# Altium schematic sheet 03_PHOTOELECTRIC_SENSOR.SchDoc
size A3
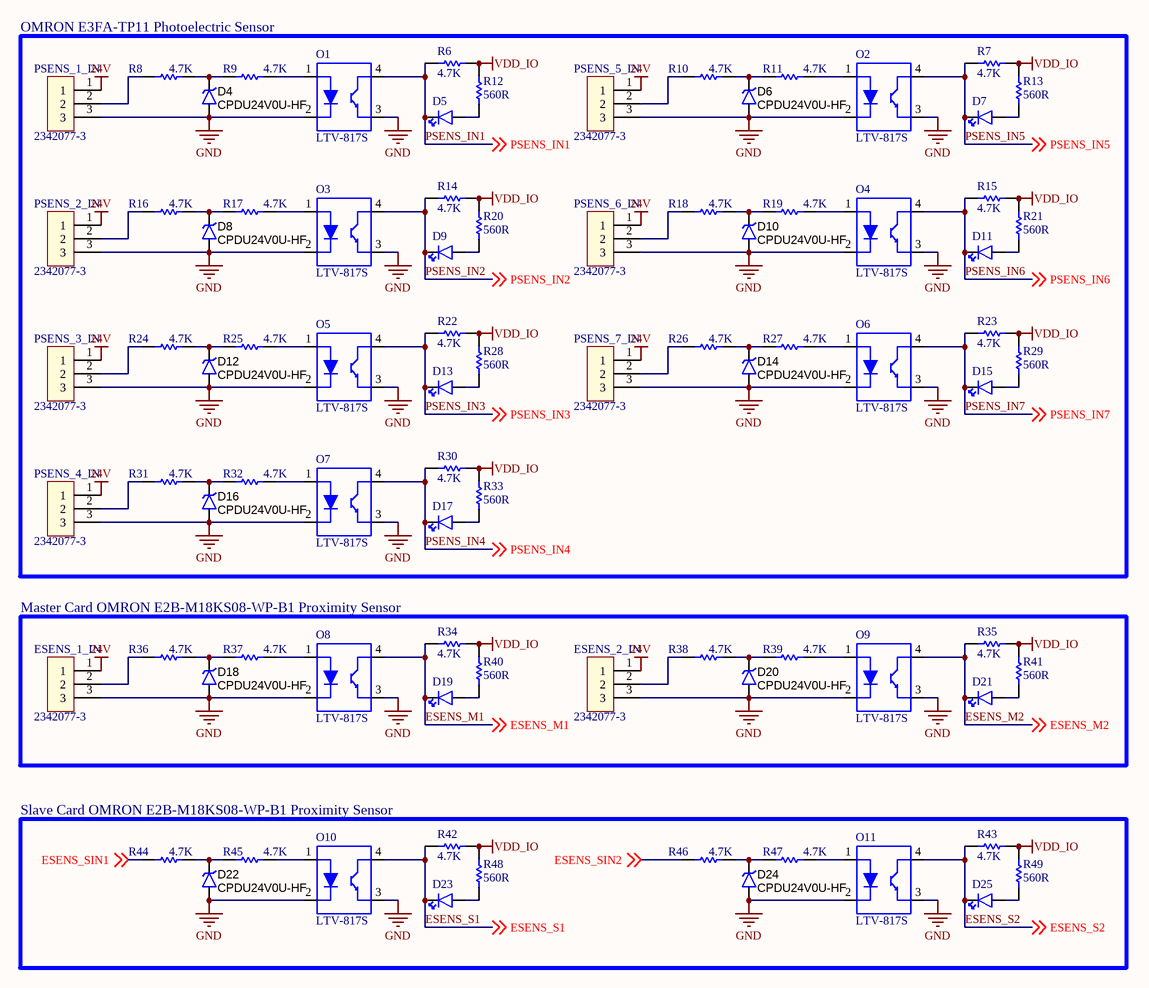
[diagram p0: 03_PHOTOELECTRIC_SENSOR.SchDoc]

## Parts
D4  CPDU24V0U-HF  [SOD523F]
D5  led_green  [805LED]  (value not drawn)
D6  CPDU24V0U-HF  [SOD523F]
D7  led_green  [805LED]  (value not drawn)
D8  CPDU24V0U-HF  [SOD523F]
D9  led_green  [805LED]  (value not drawn)
D10  CPDU24V0U-HF  [SOD523F]
D11  led_green  [805LED]  (value not drawn)
D12  CPDU24V0U-HF  [SOD523F]
D13  led_green  [805LED]  (value not drawn)
D14  CPDU24V0U-HF  [SOD523F]
D15  led_green  [805LED]  (value not drawn)
D16  CPDU24V0U-HF  [SOD523F]
D17  led_green  [805LED]  (value not drawn)
D18  CPDU24V0U-HF  [SOD523F]
D19  led_green  [805LED]  (value not drawn)
D20  CPDU24V0U-HF  [SOD523F]
D21  led_green  [805LED]  (value not drawn)
D22  CPDU24V0U-HF  [SOD523F]
D23  led_green  [805LED]  (value not drawn)
D24  CPDU24V0U-HF  [SOD523F]
D25  led_green  [805LED]  (value not drawn)
ESENS_1_IN  2342077-3  [TERM BLOCK HDR 3POS 90DEG PITCH 3.81MM]
ESENS_2_IN  2342077-3  [TERM BLOCK HDR 3POS 90DEG PITCH 3.81MM]
O1  LTV-817S  [SMD4-2.54-4.6X6.5MM]
O2  LTV-817S  [SMD4-2.54-4.6X6.5MM]
O3  LTV-817S  [SMD4-2.54-4.6X6.5MM]
O4  LTV-817S  [SMD4-2.54-4.6X6.5MM]
O5  LTV-817S  [SMD4-2.54-4.6X6.5MM]
O6  LTV-817S  [SMD4-2.54-4.6X6.5MM]
O7  LTV-817S  [SMD4-2.54-4.6X6.5MM]
O8  LTV-817S  [SMD4-2.54-4.6X6.5MM]
O9  LTV-817S  [SMD4-2.54-4.6X6.5MM]
O10  LTV-817S  [SMD4-2.54-4.6X6.5MM]
O11  LTV-817S  [SMD4-2.54-4.6X6.5MM]
PSENS_1_IN  2342077-3  [TERM BLOCK HDR 3POS 90DEG PITCH 3.81MM]
PSENS_2_IN  2342077-3  [TERM BLOCK HDR 3POS 90DEG PITCH 3.81MM]
PSENS_3_IN  2342077-3  [TERM BLOCK HDR 3POS 90DEG PITCH 3.81MM]
PSENS_4_IN  2342077-3  [TERM BLOCK HDR 3POS 90DEG PITCH 3.81MM]
PSENS_5_IN  2342077-3  [TERM BLOCK HDR 3POS 90DEG PITCH 3.81MM]
PSENS_6_IN  2342077-3  [TERM BLOCK HDR 3POS 90DEG PITCH 3.81MM]
PSENS_7_IN  2342077-3  [TERM BLOCK HDR 3POS 90DEG PITCH 3.81MM]
R6  4.7K  [603R]
R7  4.7K  [603R]
R8  4.7K  [603R]
R9  4.7K  [603R]
R10  4.7K  [603R]
R11  4.7K  [603R]
R12  560R  [603R]
R13  560R  [603R]
R14  4.7K  [603R]
R15  4.7K  [603R]
R16  4.7K  [603R]
R17  4.7K  [603R]
R18  4.7K  [603R]
R19  4.7K  [603R]
R20  560R  [603R]
R21  560R  [603R]
R22  4.7K  [603R]
R23  4.7K  [603R]
R24  4.7K  [603R]
R25  4.7K  [603R]
R26  4.7K  [603R]
R27  4.7K  [603R]
R28  560R  [603R]
R29  560R  [603R]
R30  4.7K  [603R]
R31  4.7K  [603R]
R32  4.7K  [603R]
R33  560R  [603R]
R34  4.7K  [603R]
R35  4.7K  [603R]
R36  4.7K  [603R]
R37  4.7K  [603R]
R38  4.7K  [603R]
R39  4.7K  [603R]
R40  560R  [603R]
R41  560R  [603R]
R42  4.7K  [603R]
R43  4.7K  [603R]
R44  4.7K  [603R]
R45  4.7K  [603R]
R46  4.7K  [603R]
R47  4.7K  [603R]
R48  560R  [603R]
R49  560R  [603R]

## Blocks framed on the sheet
OMRON E3FA-TP11 Photoelectric Sensor: D4-D17 O1-O7 PSENS_1_IN PSENS_2_IN PSENS_3_IN PSENS_4_IN PSENS_5_IN PSENS_6_IN PSENS_7_IN R6-R33
Master Card OMRON E2B-M18KS08-WP-B1 Proximity Sensor: D18-D21 ESENS_1_IN ESENS_2_IN O8 O9 R34-R41
Slave Card OMRON E2B-M18KS08-WP-B1 Proximity Sensor: D22-D25 O10 O11 R42-R49

## Nets
24V: ESENS_1_IN.1 ESENS_2_IN.1 PSENS_1_IN.1 PSENS_2_IN.1 PSENS_3_IN.1 PSENS_4_IN.1 PSENS_5_IN.1 PSENS_6_IN.1 PSENS_7_IN.1
GND: D4.1 D6.1 D8.1 D10.1 D12.1 D14.1 D16.1 D18.1 D20.1 D22.1 D24.1 ESENS_1_IN.3 ESENS_2_IN.3 O1.2(CATHODE) O1.3(EMITER) O2.2(CATHODE) O2.3(EMITER) O3.2(CATHODE) O3.3(EMITER) O4.2(CATHODE) O4.3(EMITER) O5.2(CATHODE) O5.3(EMITER) O6.2(CATHODE) O6.3(EMITER) O7.2(CATHODE) O7.3(EMITER) O8.2(CATHODE) O8.3(EMITER) O9.2(CATHODE) O9.3(EMITER) O10.2(CATHODE) O10.3(EMITER) O11.2(CATHODE) O11.3(EMITER) PSENS_1_IN.3 PSENS_2_IN.3 PSENS_3_IN.3 PSENS_4_IN.3 PSENS_5_IN.3 PSENS_6_IN.3 PSENS_7_IN.3
VDD_IO: R6.2 R7.2 R12.2 R13.2 R14.2 R15.2 R20.2 R21.2 R22.2 R23.2 R28.2 R29.2 R30.2 R33.2 R34.2 R35.2 R40.2 R41.2 R42.2 R43.2 R48.2 R49.2
ESENS_M1: D19.2(K) O8.4(COLLECTOR) R34.1 ; off-sheet ESENS_M1
ESENS_M2: D21.2(K) O9.4(COLLECTOR) R35.1 ; off-sheet ESENS_M2
ESENS_S1: D23.2(K) O10.4(COLLECTOR) R42.1 ; off-sheet ESENS_S1
ESENS_S2: D25.2(K) O11.4(COLLECTOR) R43.1 ; off-sheet ESENS_S2
ESENS_SIN1: R44.1 ; off-sheet ESENS_SIN1
ESENS_SIN2: R46.1 ; off-sheet ESENS_SIN2
PSENS_IN1: D5.2(K) O1.4(COLLECTOR) R6.1 ; off-sheet PSENS_IN1
PSENS_IN2: D9.2(K) O3.4(COLLECTOR) R14.1 ; off-sheet PSENS_IN2
PSENS_IN3: D13.2(K) O5.4(COLLECTOR) R22.1 ; off-sheet PSENS_IN3
PSENS_IN4: D17.2(K) O7.4(COLLECTOR) R30.1 ; off-sheet PSENS_IN4
PSENS_IN5: D7.2(K) O2.4(COLLECTOR) R7.1 ; off-sheet PSENS_IN5
PSENS_IN6: D11.2(K) O4.4(COLLECTOR) R15.1 ; off-sheet PSENS_IN6
PSENS_IN7: D15.2(K) O6.4(COLLECTOR) R23.1 ; off-sheet PSENS_IN7
NetD4_2: D4.2 R8.2 R9.1
NetD5_1: D5.1(A) R12.1
NetD6_2: D6.2 R10.2 R11.1
NetD7_1: D7.1(A) R13.1
NetD8_2: D8.2 R16.2 R17.1
NetD9_1: D9.1(A) R20.1
NetD10_2: D10.2 R18.2 R19.1
NetD11_1: D11.1(A) R21.1
NetD12_2: D12.2 R24.2 R25.1
NetD13_1: D13.1(A) R28.1
NetD14_2: D14.2 R26.2 R27.1
NetD15_1: D15.1(A) R29.1
NetD16_2: D16.2 R31.2 R32.1
NetD17_1: D17.1(A) R33.1
NetD18_2: D18.2 R36.2 R37.1
NetD19_1: D19.1(A) R40.1
NetD20_2: D20.2 R38.2 R39.1
NetD21_1: D21.1(A) R41.1
NetD22_2: D22.2 R44.2 R45.1
NetD23_1: D23.1(A) R48.1
NetD24_2: D24.2 R46.2 R47.1
NetD25_1: D25.1(A) R49.1
NetESENS_1_IN_2: ESENS_1_IN.2 R36.1
NetESENS_2_IN_2: ESENS_2_IN.2 R38.1
NetO1_1: O1.1(ANODE) R9.2
NetO2_1: O2.1(ANODE) R11.2
NetO3_1: O3.1(ANODE) R17.2
NetO4_1: O4.1(ANODE) R19.2
NetO5_1: O5.1(ANODE) R25.2
NetO6_1: O6.1(ANODE) R27.2
NetO7_1: O7.1(ANODE) R32.2
NetO8_1: O8.1(ANODE) R37.2
NetO9_1: O9.1(ANODE) R39.2
NetO10_1: O10.1(ANODE) R45.2
NetO11_1: O11.1(ANODE) R47.2
NetPSENS_1_IN_2: PSENS_1_IN.2 R8.1
NetPSENS_2_IN_2: PSENS_2_IN.2 R16.1
NetPSENS_3_IN_2: PSENS_3_IN.2 R24.1
NetPSENS_4_IN_2: PSENS_4_IN.2 R31.1
NetPSENS_5_IN_2: PSENS_5_IN.2 R10.1
NetPSENS_6_IN_2: PSENS_6_IN.2 R18.1
NetPSENS_7_IN_2: PSENS_7_IN.2 R26.1

## Library data of the parts
D4 D6 D8 D10 D12 D14 D16 D18 D20 D22 D24 = TVS DIODE 24VWM 50V 0603/SOD523F CPDU24V0U-HF: 50V Clamp 3A (8/20µs) Ipp Tvs Diode Surface Mount 0603/SOD-523F; Manufacturer: Comchip Technology; Type: Zener; Voltage - Reverse Standoff (Typ): 24V (Max); Voltage - Breakdown (Min): 26.5V; Power - Peak Pulse: 150W; Power Line Protection: No; Unidirectional Channels: 1; Digi-Key Part Number: 641-1679-1-ND; Manufacturer Part Number: CPDU24V0U-HF; Voltage - Clamping (Max) @ Ipp: 50V; Operating Temperature: -55°C ~ 125°C (TJ); Package / Case: 0603/SOD-523F; Value: CPDU24V0U-HF
D5 D7 D9 D11 D13 D15 D17 D19 D21 D23 D25 = LED_GREEN_0805: LED 2X1.2MM 570NM GN WTR CLR SMD; Millicandela Rating: 50mcd; Voltage - Forward (Vf): 2.1V; value: led_green; Digi-Key Part Number: 754-1127-1-ND; Case: 0805; Viewing Angle: -
ESENS_1_IN ESENS_2_IN PSENS_1_IN PSENS_2_IN PSENS_3_IN PSENS_4_IN PSENS_5_IN PSENS_6_IN PSENS_7_IN = TERM BLOCK HDR 3POS 90DEG 3.81MM: 3 Position Terminal Block Header, Male Pins, Shrouded (4 Side) 0.150" (3.81mm) 90°, Right Angle - Through Hole; Manufacturer: TE Connectivity AMP Connectors; Contact Tail Length: 0.075" (1.90mm); Digi-Key Part Number: A145322-ND; Value: 2342077-3; Pitch: 0.150" (3.81mm); Header Orientation: 90°, Right Angle; Insulation Height: 0.285" (7.25mm)
O1-O11 = OPTOISOLATR 5KV TRANSISTOR 4-SMD LTV-817S: Optoisolator Transistor Output 5000Vrms 1 Channel 4-SMD; Voltage - Output (Max): 35V; Number of Channels: 1; Rise / Fall Time (Typ): 4µs, 3µs; Current - DC Forward (If) (Max): 50 mA; Voltage - Forward (Vf) (Typ): 1.2V; Output Type: Transistor; Voltage - Isolation: 5000Vrms; Package / Case: 4-SMD, Gull Wing; Operating Temperature: -30°C ~ 110°C; Value: LTV-817S; Digi-Key Part Number: 160-1367-5-ND
R6-R11 R14-R19 R22-R27 R30-R32 R34-R39 R42-R47 = RES_4.7K_OHM_%5_0.1W_0603: 4.7 kOhms ±5% 0.1W, 1/10W Chip Resistor 0603 (1608 Metric) Moisture Resistant Thick Film; Manufacturer: Yageo; Manufacturer Part Number: RC0603JR-074K7L; Temperature Coefficient: ±100ppm/°C; Value: 4.7K; Digi-Key Part Number: 311-4.7KGRTR-ND; Tolerance: ±5%; Power (Watts): 0.1W, 1/10W; Composition: Thick Film; Operating Temperature: -55°C ~ 155°C; Package / Case: 0603 (1608 Metric); Size / Dimension: 0.063" L x 0.032" W (1.60mm x 0.80mm); Height - Seated (Max): 0.022" (0.55mm); Features: Moisture Resistant
R12 R13 R20 R21 R28 R29 R33 R40 R41 R48 R49 = RES_560_OHM_%5_0.1W_0603: 560 Ohms ±5% 0.1W, 1/10W Chip Resistor 0603 (1608 Metric) Moisture Resistant Thick Film; Manufacturer: Yageo; Manufacturer Part Number: RC0603JR-07560RL; Temperature Coefficient: ±100ppm/°C; Value: 560R; Digi-Key Part Number: 311-560GRCT-ND; Tolerance: ±5%; Power (Watts): 0.1W, 1/10W; Composition: Thick Film; Operating Temperature: -55°C ~ 155°C; Package / Case: 0603 (1608 Metric); Size / Dimension: 0.063" L x 0.032" W (1.60mm x 0.80mm); Height - Seated (Max): 0.022" (0.55mm); Features: Moisture Resistant